# EasyEDA schematic SCH_PET_tlacitko_V1_2023-06-28.json
TITLE: PET Bottlecap pushbutton; REV: 1.0; Date: 2022-04-23; Sheet: 1/1; Drawn By: Ondrej Ruzicka
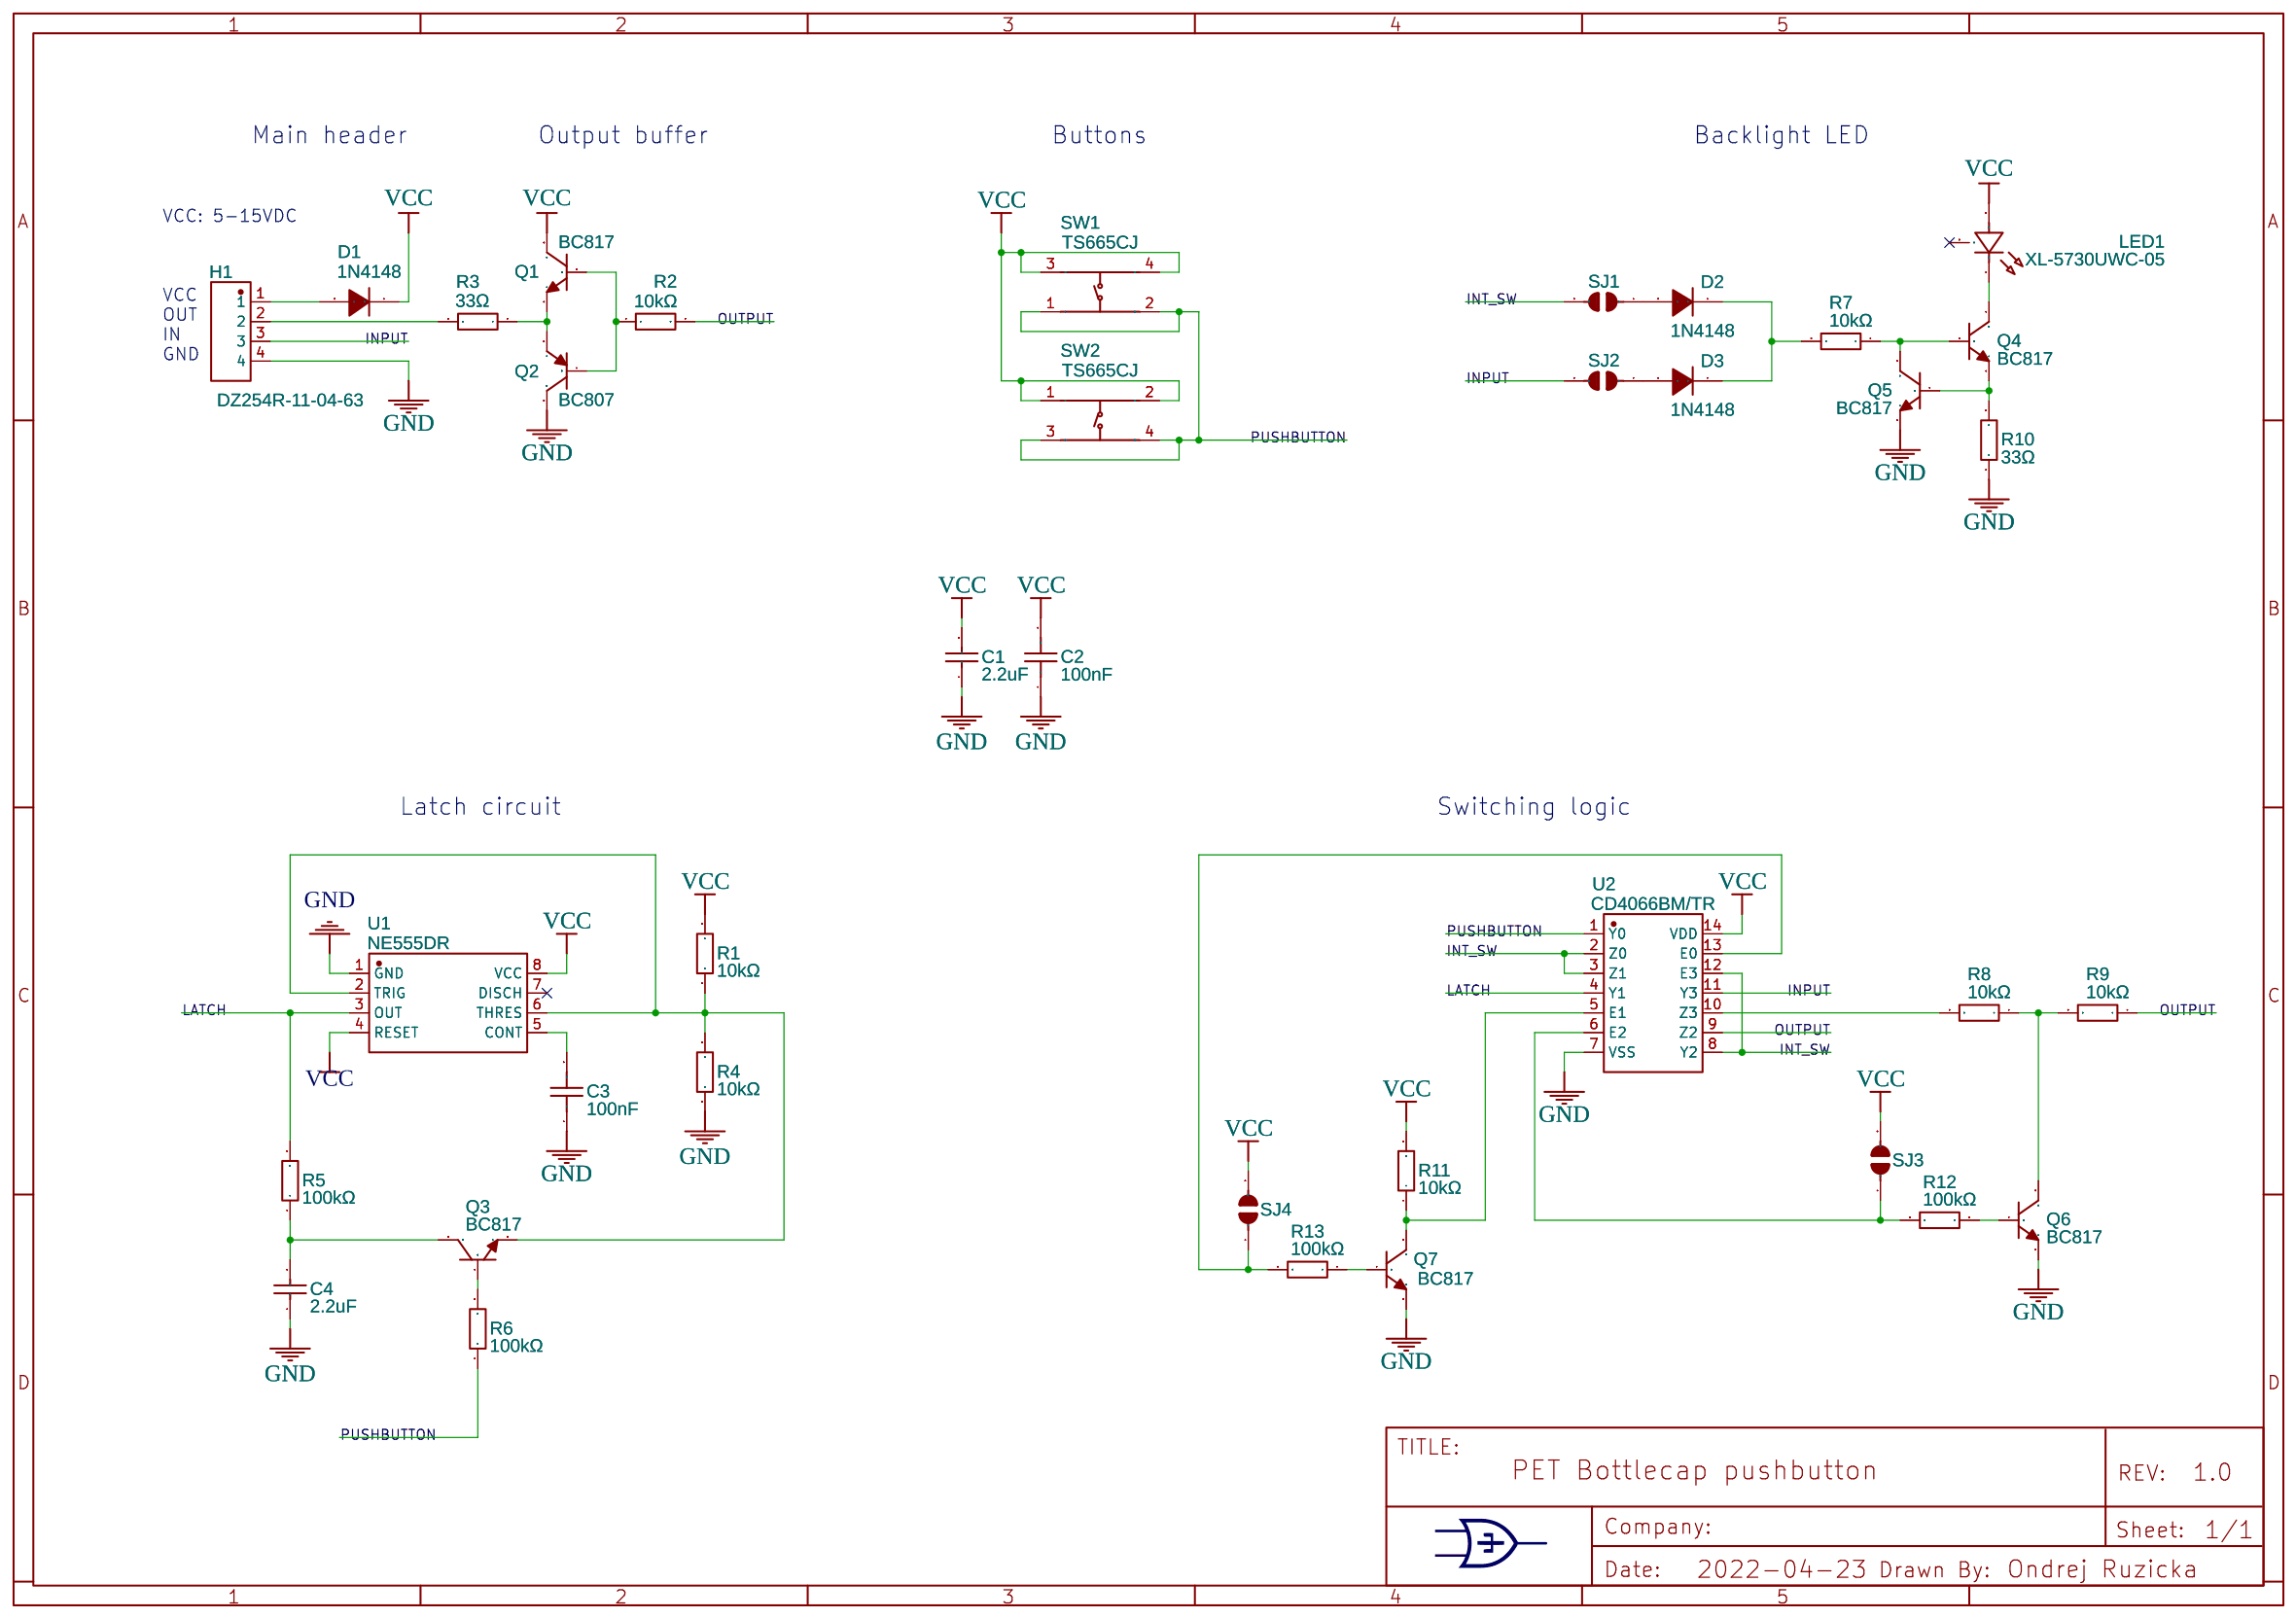
[diagram p0: schematic sheet]

## Parts
C1  2.2uF  [C0603]
C2  100nF  [C0603]
C3  100nF  [C0603]
C4  2.2uF  [C0603]
D1  1N4148  [SOD-123_L2.8-W1.8-LS3.7-RD]
D2  1N4148  [SOD-123_L2.8-W1.8-LS3.7-RD]
D3  1N4148  [SOD-123_L2.8-W1.8-LS3.7-RD]
H1  DZ254R-11-04-63  [HDR-TH_4P-P2.54-V-M]
LED1  XL-5730UWC-05  [LED-SMD_3P-L5.7-W3.0-RD]
Q1  BC817  [SOT-23-3_L2.9-W1.4-P1.90-LS2.6-BR]
Q2  BC807  [SOT-23-3_L2.9-W1.3-P1.90-LS2.4-BR]
Q3  BC817  [SOT-23-3_L2.9-W1.4-P1.90-LS2.6-BR]
Q4  BC817  [SOT-23-3_L2.9-W1.4-P1.90-LS2.6-BR]
Q5  BC817  [SOT-23-3_L2.9-W1.4-P1.90-LS2.6-BR]
Q6  BC817  [SOT-23-3_L2.9-W1.4-P1.90-LS2.6-BR]
Q7  BC817  [SOT-23-3_L2.9-W1.4-P1.90-LS2.6-BR]
R1  10kΩ  [R0603]
R2  10kΩ  [R0603]
R3  33Ω  [R0603]
R4  10kΩ  [R0603]
R5  100kΩ  [R0603]
R6  100kΩ  [R0603]
R7  10kΩ  [R0603]
R8  10kΩ  [R0603]
R9  10kΩ  [R0603]
R10  33Ω  [R0603]
R11  10kΩ  [R0603]
R12  100kΩ  [R0603]
R13  100kΩ  [R0603]
SJ1  SOLDERJUMPERNO  [SJ_2S-NO]
SJ2  SOLDERJUMPERNO  [SJ_2S-NO]
SJ3  SOLDERJUMPERNO  [SJ_2S-NO]
SJ4  SOLDERJUMPERNO  [SJ_2S-NO]
SW1  TS665CJ  [SW-TH_4P-L6.0-W6.0-P4.50-LS6.5]
SW2  TS665CJ  [SW-TH_4P-L6.0-W6.0-P4.50-LS6.5]
U1  NE555DR  [SOP-8_L5.0-W4.0-P1.27-LS6.0-BL]
U2  CD4066BM/TR  [SOP-14_L8.6-W3.9-P1.27-LS6.0-BL]

## Library data of the parts
C1 C4 = CL10A225KO8NNNC: Supplier: LCSC; Manufacturer: SAMSUNG; Supplier Part: C23630; JLCPCB Part Class: Basic Part
C2 C3 = CC0603KRX7R9BB104: Supplier: LCSC; Manufacturer: YAGEO; Supplier Part: C14663; JLCPCB Part Class: Basic Part
D1-D3 = 1N4148W_C115103: Supplier: LCSC; Manufacturer: Jingdao; Manufacturer Part: 1N4148W; Supplier Part: C115103; JLCPCB Part Class: Extended Part
H1 = DZ254R-11-04-63: Supplier: LCSC; Supplier Part: C2935910; Manufacturer: DEALON(德艺隆); Contributor: LCSC; JLCPCB Part Class: Extended Part
LED1 = XL-5730UWC-05: Supplier: LCSC; Supplier Part: C2843887; Manufacturer: XINGLIGHT(成兴光); JLCPCB Part Class: Extended Part; Contributor: LCSC
Q1 Q3-Q7 = BC817_C475629: Supplier: LCSC; Supplier Part: C475629; Manufacturer: Shikues; Contributor: LCSC; JLCPCB Part Class: Extended Part
Q2 = BC807-25_C556162: Supplier: LCSC; Supplier Part: C556162; Manufacturer: Slkor(SLKORMICRO Elec.); Manufacturer Part: BC807-25; Contributor: LCSC; JLCPCB Part Class: Extended Part
R1 R2 R4 R7-R9 R11 = 0603WAF1002T5E: Supplier: LCSC; Manufacturer: UniOhm; Supplier Part: C25804; Resistance (Ohms): 10K; JLCPCB Part Class: Basic Part
R3 R10 = 0603WAF330JT5E: Supplier: LCSC; Manufacturer: UniOhm; Supplier Part: C23140; Resistance (Ohms): 33; JLCPCB Part Class: Basic Part
R5 R6 R12 R13 = 0603WAF1003T5E: Supplier: LCSC; Manufacturer: UniOhm; Supplier Part: C25803; Resistance (Ohms): 100K; JLCPCB Part Class: Basic Part
SJ1-SJ4 = SOLDERJUMPERNO: Solder Jumper; Contributor: Ardno
SW1 SW2 = TS665CJ: Supplier: LCSC; Supplier Part: C393938; Manufacturer: SHOU HAN; Contributor: LCSC; JLCPCB Part Class: Extended Part
U1 = NE555DR_C695838: Supplier: LCSC; Supplier Part: C695838; Manufacturer: UMW(Youtai Semiconductor Co., Ltd.); Contributor: LCSC; JLCPCB Part Class: Extended Part
U2 = CD4066BM/TR: Supplier: LCSC; Supplier Part: C512770; Manufacturer: HGSEMI; Contributor: LCSC; JLCPCB Part Class: Extended Part

## Nets
GND: C1.1 C2.1 C3.1 C4.1 H1.4 Q2.3(C) Q5.2(E) Q6.2(E) Q7.2(E) R4.1 R10.1 U1.1(GND) U2.7(VSS)
VCC: C1.2 C2.2 D1.1(K) LED1.2(A) Q1.3(C) R1.2 R11.2 SJ3.2 SJ4.2 SW1.3(C) SW1.4(D) SW2.1(A) SW2.2(B) U1.4(RESET) U1.8(VCC) U2.14(VDD)
INPUT: H1.3 SJ2.2 U2.11(Y3)
INT_SW: SJ1.2 U2.2(Z0) U2.3(Z1) U2.8(Y2) U2.12(E3)
LATCH: R5.2 U1.3(OUT) U2.4(Y1)
OUTPUT: R2.2 R9.1 U2.9(Z2)
PUSHBUTTON: R6.1 SW1.1(A) SW1.2(B) SW2.3(C) SW2.4(D) U2.1(Y0)
Net-(C3-2): C3.2 U1.5(CONT)
Net-(C4-2): C4.2 Q3.3(C) R5.1
Net-(D1-2): D1.2(A) H1.1
Net-(D2-1): D2.1(K) D3.1(K) R7.2
Net-(D2-2): D2.2(A) SJ1.1
Net-(D3-2): D3.2(A) SJ2.1
Net-(H1-2): H1.2 R3.2
Net-(LED1-1): LED1.1(K) Q4.3(C)
Net-(Q1-1): Q1.1(B) Q2.1(B) R2.1
Net-(Q1-2): Q1.2(E) Q2.2(E) R3.1
Net-(Q3-1): Q3.1(B) R6.2
Net-(Q3-2): Q3.2(E) R1.1 R4.2 U1.2(TRIG) U1.6(THRES)
Net-(Q4-1): Q4.1(B) Q5.3(C) R7.1
Net-(Q4-2): Q4.2(E) Q5.1(B) R10.2
Net-(Q6-1): Q6.1(B) R12.1
Net-(Q6-3): Q6.3(C) R8.1 R9.2
Net-(Q7-1): Q7.1(B) R13.1
Net-(Q7-3): Q7.3(C) R11.1 U2.5(E1)
Net-(R8-2): R8.2 U2.10(Z3)
Net-(R12-2): R12.2 SJ3.1 U2.6(E2)
Net-(R13-2): R13.2 SJ4.1 U2.13(E0)

Not connected (* = marked no-connect by the designer): LED1 3*; U1 7(DISCH)*

## Notes on the sheet
- Main header
- Output buffer
- Buttons
- Backlight LED
- VCC: 5-15VDC
- VCC
- IN
- OUT
- GND
- Latch circuit
- Switching logic
